# Altium schematic sheet 32m1-ssm.SchDoc
size A4
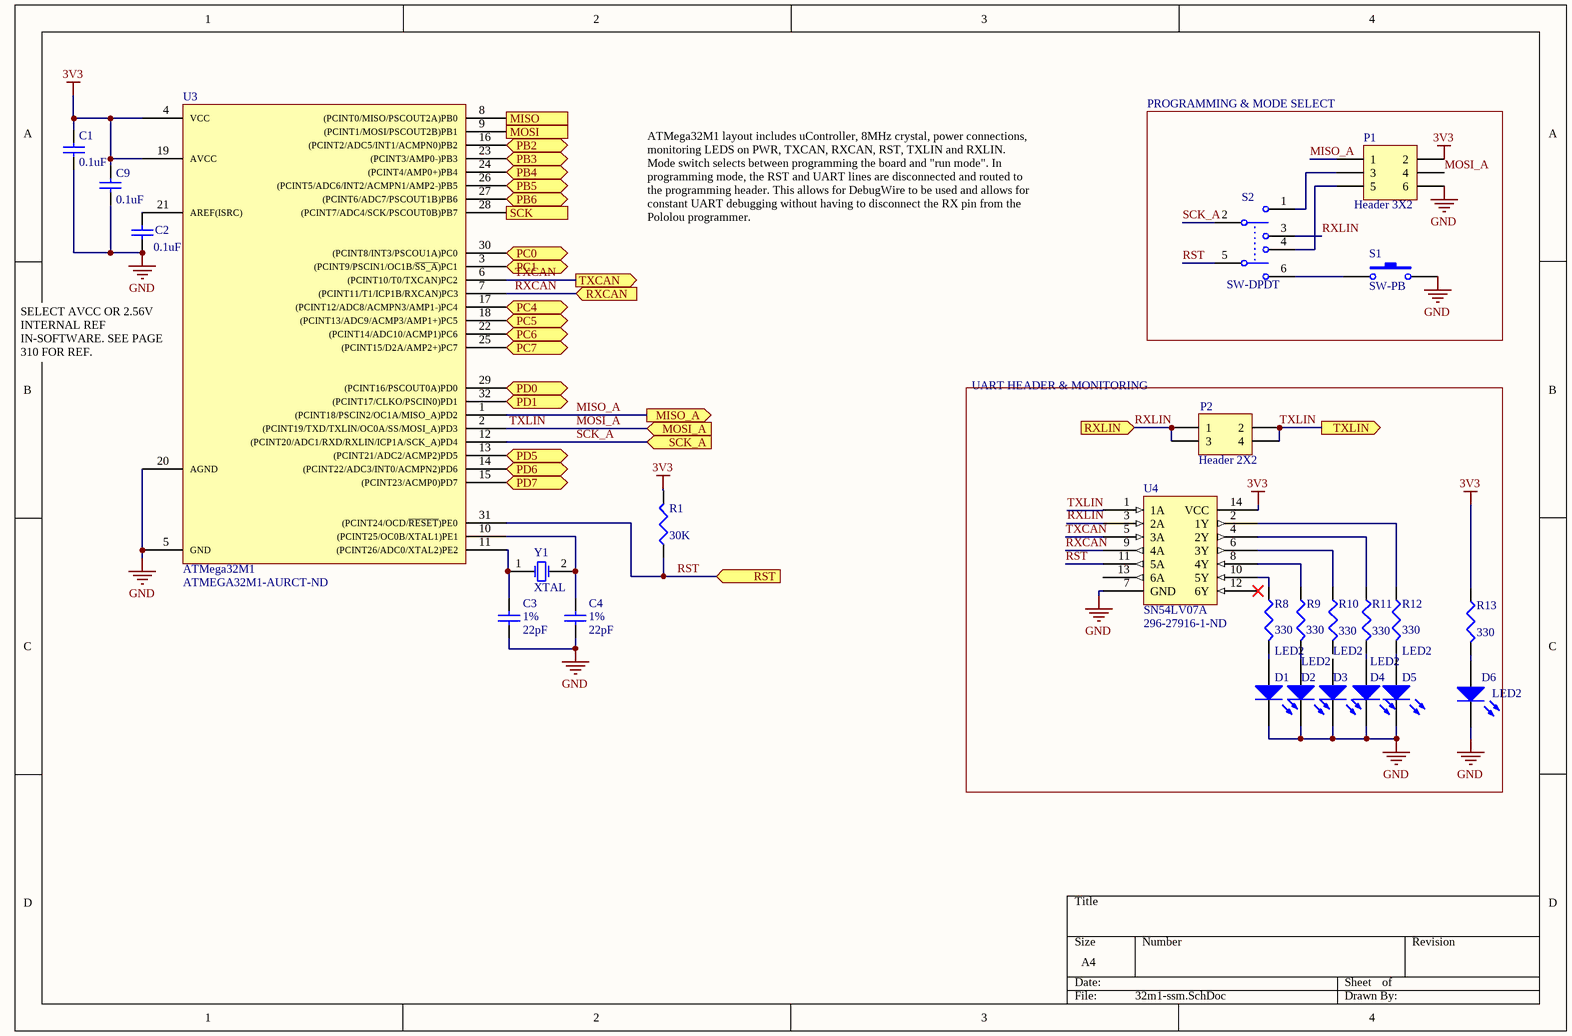
[diagram p0: 32m1-ssm.SchDoc]

## Parts
C1  value 0.1uF  [C1206]  (hidden comment: Cap Semi)
C2  value 0.1uF  [C1206]  (hidden comment: Cap Semi)
C3  1%  value 22pF  [C1206]
C4  1%  value 22pF  [C1206]
C9  value 0.1uF  [C1206]  (hidden comment: Cap Semi)
D1  LED2  [3.2X1.6X1.1]
D2  LED2  [3.2X1.6X1.1]
D3  LED2  [3.2X1.6X1.1]
D4  LED2  [3.2X1.6X1.1]
D5  LED2  [3.2X1.6X1.1]
D6  LED2  [3.2X1.6X1.1]
P1  Header 3X2  [HDR2X3]
P2  Header 2X2  [HDR2X2]
R1  value 30K  [J1-0603]  (hidden comment: Res3)
R8  value 330  [J1-0603]  (hidden comment: Res3)
R9  value 330  [J1-0603]  (hidden comment: Res3)
R10  value 330  [J1-0603]  (hidden comment: Res3)
R11  value 330  [J1-0603]  (hidden comment: Res3)
R12  value 330  [J1-0603]  (hidden comment: Res3)
R13  value 330  [J1-0603]  (hidden comment: Res3)
S1  SW-PB  [SPST-2]
S2  SW-DPDT  [PCBComponent_1]
U3  ATMega32M1  Supplier Part Number 1: ATMEGA32M1-AURCT-ND  [QFP80P900X900X120-32N]
U4  SN54LV07A  Supplier Part Number: 296-27916-1-ND  [SOT402-1_N]
Y1  XTAL  [R38]

## Blocks framed on the sheet
PROGRAMMING & MODE SELECT: P1 S1 S2
UART HEADER & MONITORING: D1-D6 P2 R8-R13 U4

## Ports
MISO (in), MISO_A (out), MOSI (out), MOSI_A (in), PB2 (bidir), PB3 (bidir), PB4 (bidir), PB5 (bidir), PB6 (bidir), PC0 (bidir), PC1 (bidir), PC4 (bidir), PC5 (bidir), PC6 (bidir), PC7 (bidir), PD0 (bidir), PD1 (bidir), PD5 (bidir), PD6 (bidir), PD7 (bidir), RST (in), RXCAN (in), RXLIN (in), SCK (out), SCK_A (in), TXCAN (out), TXLIN (out)

## Nets
3V3: C1.2 C9.2 P1.2 R1.2 R13.1 U3.4(VCC) U3.19(AVCC) U4.14(VCC)
GND: C1.1 C2.2 C3.1 C4.1 C9.1 D1.2(K) D2.2(K) D3.2(K) D4.2(K) D5.2(K) D6.2(K) P1.6 S1.2 U3.5(GND) U3.20(AGND) U4.7(GND)
MISO: U3.8((PCINT0/MISO/PSCOUT2A)PB0) ; port MISO
MISO_A: P1.1 U3.1((PCINT18/PSCIN2/OC1A/MISO_A)PD2) ; port MISO_A
MOSI: U3.9((PCINT1/MOSI/PSCOUT2B)PB1) ; port MOSI
MOSI_A: P1.4 P2.2 P2.4 U3.2((PCINT19/TXD/TXLIN/OC0A/SS/MOSI_A)PD3) U4.1(1A) ; port TXLIN, port MOSI_A  [also labelled TXLIN]
PB2: U3.16((PCINT2/ADC5/INT1/ACMPN0)PB2) ; port PB2
PB3: U3.23((PCINT3/AMP0-)PB3) ; port PB3
PB4: U3.24((PCINT4/AMP0+)PB4) ; port PB4
PB5: U3.26((PCINT5/ADC6/INT2/ACMPN1/AMP2-)PB5) ; port PB5
PB6: U3.27((PCINT6/ADC7/PSCOUT1B)PB6) ; port PB6
PC0: U3.30((PCINT8/INT3/PSCOU1A)PC0) ; port PC0
PC1: U3.3((PCINT9/PSCIN1/OC1B/~{SS_A})PC1) ; port PC1
PC4: U3.17((PCINT12/ADC8/ACMPN3/AMP1-)PC4) ; port PC4
PC5: U3.18((PCINT13/ADC9/ACMP3/AMP1+)PC5) ; port PC5
PC6: U3.22((PCINT14/ADC10/ACMP1)PC6) ; port PC6
PC7: U3.25((PCINT15/D2A/AMP2+)PC7) ; port PC7
PD0: U3.29((PCINT16/PSCOUT0A)PD0) ; port PD0
PD1: U3.32((PCINT17/CLKO/PSCIN0)PD1) ; port PD1
PD5: U3.13((PCINT21/ADC2/ACMP2)PD5) ; port PD5
PD6: U3.14((PCINT22/ADC3/INT0/ACMPN2)PD6) ; port PD6
PD7: U3.15((PCINT23/ACMP0)PD7) ; port PD7
RST: R1.1 S2.5 U3.31((PCINT24/OCD/~{RESET})PE0) U4.11(5A) ; port RST
RXCAN: U3.7((PCINT11/T1/ICP1B/RXCAN)PC3) U4.9(4A) ; port RXCAN
RXLIN: P2.1 P2.3 S2.3 U4.3(2A) ; port RXLIN
SCK: U3.28((PCINT7/ADC4/SCK/PSCOUT0B)PB7) ; port SCK
SCK_A: S2.2 U3.12((PCINT20/ADC1/RXD/RXLIN/ICP1A/SCK_A)PD4) ; port SCK_A
TXCAN: U3.6((PCINT10/T0/TXCAN)PC2) U4.5(3A) ; port TXCAN
NetC2_1: C2.1 U3.21(AREF(ISRC))
NetC3_2: C3.2 U3.11((PCINT26/ADC0/XTAL2)PE2) Y1.1(OSC1)
NetC4_2: C4.2 U3.10((PCINT25/OC0B/XTAL1)PE1) Y1.2(OSC2)
NetD1_1: D1.1(A) R8.2
NetD2_1: D2.1(A) R9.2
NetD4_1: D4.1(A) R11.2
NetD5_1: D5.1(A) R12.2
NetD6_1: D6.1(A) R13.2
NetP1_3: P1.3 S2.1
NetP1_5: P1.5 S2.4
NetR8_1: R8.1 U4.10(5Y)
NetR9_1: R9.1 U4.8(4Y)
NetR10_1: R10.1 U4.6(3Y)
NetR11_1: R11.1 U4.4(2Y)
NetR12_1: R12.1 U4.2(1Y)
NetS1_1: S1.1 S2.6

Not connected (* = marked no-connect by the designer): D3 1(A); R10 2; U4 12(6Y)* 13(6A)

## Notes on the sheet
- ATMega32M1 layout includes uController, 8MHz crystal, power connections, monitoring LEDS on PWR, TXCAN, RXCAN, RST, TXLIN and RXLIN. Mode switch selects between programming the board and "run mode". In programming mode, the RST and UART lines are disconnected and routed to the programming header. This allows for DebugWire to be used and allows for constant UART debugging without having to disconnect the RX pin from the Pololou programmer.
- (near U3) SELECT AVCC OR 2.56V INTERNAL REF IN-SOFTWARE. SEE PAGE 310 FOR REF.

## Library data of the parts
C1-C4 C9 = Cap Semi: Capacitor (Semiconductor SIM Model); Published: 8-Jun-2000; LatestRevisionDate: 29-May-2009; LatestRevisionNote: IPC-7351 Footprint Added.; PackageReference: C1206; Publisher: Altium Limited; PackageDescription: Chip Capacitor
D1-D6 = LED2: Typical RED, GREEN, YELLOW, AMBER GaAs LED; Published: 8-Jun-2000; LatestRevisionDate: 17-Jul-2002; LatestRevisionNote: Re-released for DXP Platform.; PackageVersion: Feb-2002; PackageReference: 3.2X1.6X1.1; Publisher: Altium Limited; PackageDescription: SM LED; 2 Flat Leads
P1 = Header 3X2: Header, 3-Pin, Dual row; LatestRevisionDate: 17-Jul-2002; LatestRevisionNote: Re-released for DXP Platform.; Publisher: Altium Limited
P2 = Header 2X2: Header, 2-Pin, Dual row; LatestRevisionDate: 17-Jul-2002; LatestRevisionNote: Re-released for DXP Platform.; Publisher: Altium Limited
R1 R8-R13 = Res3: Resistor; Published: 8-Jun-2000; LatestRevisionDate: 29-May-2009; LatestRevisionNote: IPC-7351 Footprint Added.; PackageReference: J1-0603; Publisher: Altium Limited; PackageDescription: Chip Resistor
S1 = SW-PB: Switch; Published: 24-Mar-1999; LatestRevisionDate: 17-Jul-2002; LatestRevisionNote: Re-released for DXP Platform.; PackageReference: SPST-2; Publisher: Altium Limited; PackageDescription: Switch; 2 Leads
S2 = SW-DPDT: Double-Pole, Double-Throw Switch; Published: 24-Mar-1999; LatestRevisionDate: 17-Jul-2002; LatestRevisionNote: Re-released for DXP Platform.; PackageReference: DPDT-6; Publisher: Altium Limited; PackageDescription: Switch; 6 Leads
U3 = ATMega32M1: Atmel 8-bit AVR microcontroller.; Supplier 1: Digi-Key
U4 = SN54LV07A: Six element 1-bit non-inverting open-drain buffer.; Supplier: Digi-Key
Y1 = XTAL: Crystal Oscillator; Published: 8-Jun-2000; LatestRevisionDate: 17-Jul-2002; LatestRevisionNote: Re-released for DXP Platform.; PackageReference: R38; Publisher: Altium Limited; PackageDescription: Crystal, Thru-Hole; 2 Leads; Body 3.1 x 8.2 mm (Dia.xH)